# EAGLE design bcdwatch (EAGLE 6.6.0)
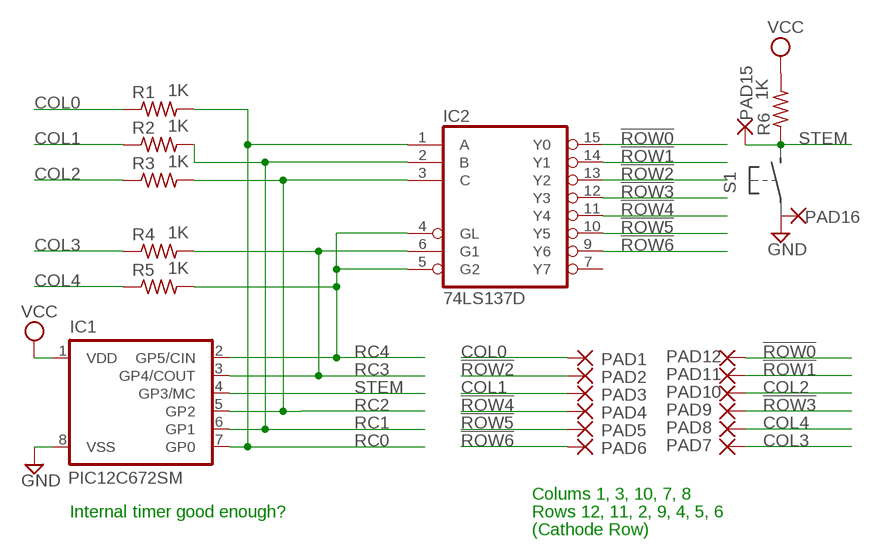
[diagram p0: schematic, sheet 1]

## Parts
IC1  PIC12C672SM  [SO-08M]
IC2  74LS137D  [SO16]
PAD1  SMD2  [SMD1,27-2,54]
PAD2  SMD2  [SMD1,27-2,54]
PAD3  SMD2  [SMD1,27-2,54]
PAD4  SMD2  [SMD1,27-2,54]
PAD5  SMD2  [SMD1,27-2,54]
PAD6  SMD2  [SMD1,27-2,54]
PAD7  SMD2  [SMD1,27-2,54]
PAD8  SMD2  [SMD1,27-2,54]
PAD9  SMD2  [SMD1,27-2,54]
PAD10  SMD2  [SMD1,27-2,54]
PAD11  SMD2  [SMD1,27-2,54]
PAD12  SMD2  [SMD1,27-2,54]
PAD15  SMD2  [SMD1,27-2,54]
PAD16  SMD2  [SMD1,27-2,54]
R1  1K  R-US_R0805  [R0805]
R2  1K  R-US_R0805  [R0805]
R3  1K  R-US_R0805  [R0805]
R4  1K  R-US_R0805  [R0805]
R5  1K  R-US_R0805  [R0805]
R6  1K  R-US_R0805  [R0805]

## Nets
!ROW0: IC2.15(Y0) PAD12.1(P)
!ROW1: IC2.14(Y1) PAD11.1(P)
!ROW2: IC2.13(Y2) PAD2.1(P)
!ROW3: IC2.12(Y3) PAD9.1(P)
!ROW4: IC2.11(Y4) PAD4.1(P)
!ROW5: IC2.10(Y5) PAD5.1(P)
!ROW6: IC2.9(Y6) PAD6.1(P)
COL0: PAD1.1(P) R1.1
COL1: PAD3.1(P) R2.1
COL2: PAD10.1(P) R3.1
COL3: PAD7.1(P) R4.1
COL4: PAD8.1(P) R5.1
GND: IC1.8(VSS) PAD16.1(P)
RC0: IC1.7(GP0) IC2.1(A) R1.2
RC1: IC1.6(GP1) IC2.2(B) R2.2
RC2: IC1.5(GP2) IC2.3(C) R3.2
RC3: IC1.3(GP4/COUT) IC2.6(G1) R4.2
RC4: IC1.2(GP5/CIN) IC2.4(GL) IC2.5(G2) R5.2
STEM: IC1.4(GP3/MC) PAD15.1(P) R6.1
VCC: IC1.1(VDD) R6.2
Unconnected: IC2.7(Y7)

## Notes on the sheet
- Colums 1, 3, 10, 7, 8
- Internal timer good enough? | Rows 12, 11, 2, 9, 4, 5, 6
- (Cathode Row)

## Power pins joined to a net without a drawn wire
GND: IC2.8(GND)
VCC: IC2.16(VCC)

## Library data of the parts
IC1 = microchip:PIC12C*?: MICROCONTROLLER; MF: MICROCHIP; MPN: PIC12C672-04/SM; OC_FARNELL: 1137297; OC_NEWARK: 72K7294
IC2 = 74xx-us:74*137: 3-line to 8-line DECODER/DEMULTIPLEXER, address LATCH
PAD1-PAD12 PAD15 PAD16 = wirepad:SMD2: SMD PAD
R1-R6 = rcl:R-US_: RESISTOR, American symbol

## Board
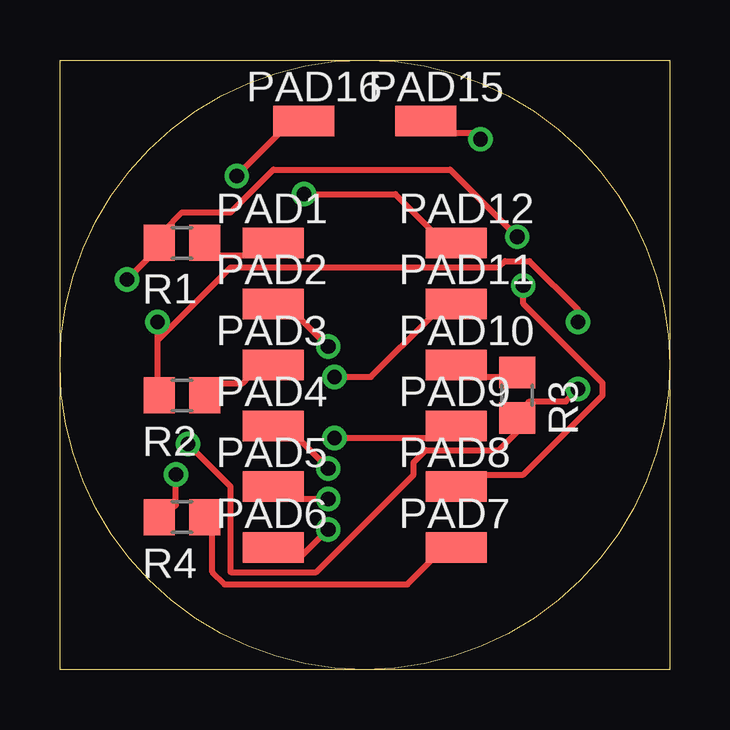
[diagram p1: board, top side]
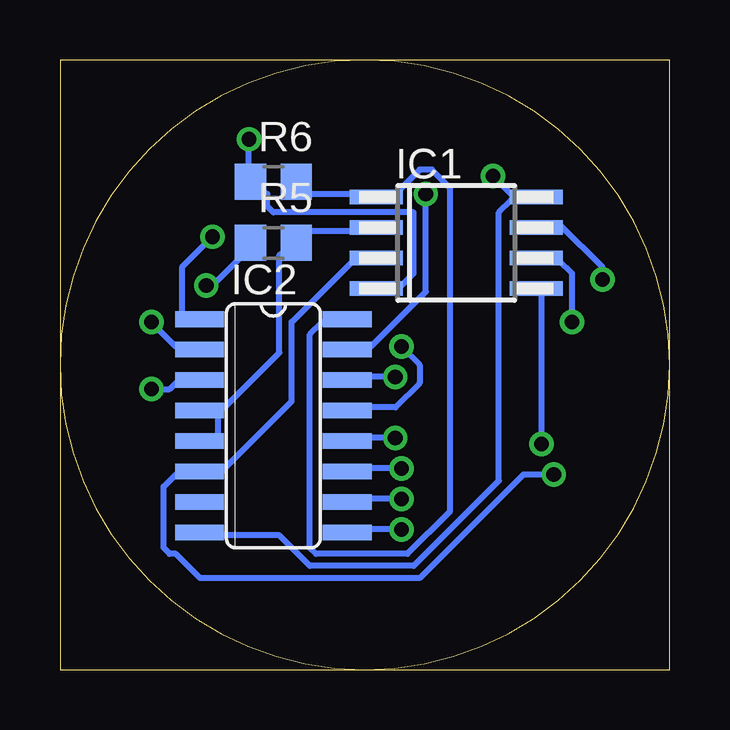
[diagram p2: board, bottom side, seen from below]

Size 25.4 x 25.4 mm. Coordinates in mm from the lower left corner, seen from the top.
Outline: 0,12.7 0,0 25.4,0 25.4,12.7
Outline: 0,12.7 0,25.4 24.13,25.4 25.4,25.4 25.4,12.7
Outline: 0,12.7 arc-180 25.4,12.7
Outline: 25.4,12.7 arc-180 0,12.7
Copper layers (1*16): Top 0.035mm / dielectric 1.5mm / Bottom 0.035mm
Design rules "default": minimum track width 10mil, minimum drill 24mil, track to track 8mil, track to pad 8mil, pad to pad 8mil, via to via 8mil, smd to smd 8mil, copper to edge 40mil, drill to drill 8mil, minimum pad ring 10mil, minimum via ring 8mil, stop-mask expansion 4mil, vias tented up to drill 0mil, thermal gap 10mil

### Footprints (pad centres in the part's own frame; a part is rotated, then mirrored left to right if it is on the bottom)
SO-08M = smd 0.6 x 2.2: 1 -1.905,-3.33; 2 -0.635,-3.33; 3 0.635,-3.33; 4 1.905,-3.33; 5 1.905,3.33; 6 0.635,3.33; 7 -0.635,3.33; 8 -1.905,3.33
SO16 = smd 0.66 x 2.032: 1 -4.445,-3.073; 2 -3.175,-3.073; 3 -1.905,-3.073; 4 -0.635,-3.073; 5 0.635,-3.073; 6 1.905,-3.073; 7 3.175,-3.073; 8 4.445,-3.073; 9 4.445,3.073; 10 3.175,3.073; 11 1.905,3.073; 12 0.635,3.073; 13 -0.635,3.073; 14 -1.905,3.073; 15 -3.175,3.073; 16 -4.445,3.073
SMD1,27-2,54 = smd 1.27 x 2.54: 1 0,0
R0805 = smd 1.3 x 1.5: 1 -0.95,0; 2 0.95,0

### Placement (x,y rotation side)
IC1  8.89,17.78 270 bottom
IC2  16.51,10.16 270 bottom
PAD1  8.89,17.78 270 top
PAD2  8.89,15.24 270 top
PAD3  8.89,12.7 270 top
PAD4  8.89,10.16 270 top
PAD5  8.89,7.62 270 top
PAD6  8.89,5.08 270 top
PAD7  16.51,5.08 270 top
PAD8  16.51,7.62 270 top
PAD9  16.51,10.16 270 top
PAD10  16.51,12.7 270 top
PAD11  16.51,15.24 270 top
PAD12  16.51,17.78 270 top
PAD15  15.24,22.86 270 top
PAD16  10.16,22.86 270 top
R1  5.08,17.78 180 top
R2  5.08,11.43 180 top
R3  19.05,11.43 270 top
R4  5.08,6.35 180 top
R5  16.51,17.78 0 bottom
R6  16.51,20.32 0 bottom

### Tracks (layer width: path | path; a pad name or v marks a point on that pad's centre or on a via)
!ROW0  (via drill 0.61)
  Top 0.254: v10.16,19.81 13.97,19.81 15.49,18.29 PAD12.1
  Bottom 0.254: v10.16,19.81 10.16,15.75 12.45,13.46 IC2.15
!ROW1  (via drill 0.61)
  Top 0.254: v11.43,12.19 12.95,12.19 15.49,14.73 PAD11.1
  Bottom 0.254: v11.43,12.19 12.45,12.19 IC2.14
!ROW2  (via drill 0.61)
  Top 0.254: v11.18,13.46 9.91,14.73 PAD2.1
  Bottom 0.254: v11.18,13.46 10.41,12.7 10.41,11.94 11.43,10.92 12.45,10.92 IC2.13
!ROW3  (via drill 0.61)
  Top 0.254: v11.43,9.65 15.49,9.65 PAD9.1
  Bottom 0.254: v11.43,9.65 12.45,9.65 IC2.12
!ROW4  (via drill 0.61)
  Top 0.254: v11.18,8.38 9.91,9.65 PAD4.1
  Bottom 0.254: v11.18,8.38 12.45,8.38 IC2.11
!ROW5  (via drill 0.61)
  Top 0.254: v11.18,7.11 9.91,7.11 PAD5.1
  Bottom 0.254: v11.18,7.11 12.45,7.11 IC2.10
!ROW6  (via drill 0.61)
  Top 0.254: v11.18,5.84 9.91,4.57 PAD6.1
  Bottom 0.254: v11.18,5.84 12.45,5.84 IC2.9
COL0
  Top 0.254: R1.1 6.35,17.27 7.87,17.27 PAD1.1
COL1
  Top 0.254: R2.1 6.35,11.94 7.62,11.94 7.87,12.19 PAD3.1
COL2
  Top 0.254: R3.1 18.54,12.19 17.53,12.19 PAD10.1
COL3
  Top 0.254: R4.1 6.35,5.84 6.35,4.06 6.86,3.56 14.48,3.56 15.49,4.57 PAD7.1
COL4  (via drill 0.61)
  Top 0.254: v19.3,16 19.3,15.24 22.61,11.94 22.61,11.43 19.3,8.13 17.53,8.13 PAD8.1
  Bottom 0.254: v19.3,16 19.05,16 17.78,17.27 R5.1
GND  (via drill 0.61)
  Top 0.254: v7.37,20.57 9.14,22.35 PAD16.1
  Bottom 0.254: IC2.8 18.8,5.59 16.26,5.59 14.99,4.32 10.67,4.32 7.11,7.87 7.11,19.05 6.6,19.56 IC1.8 6.6,19.81 v7.37,20.57
RC0  (via drill 0.61)
  Top 0.254: v2.79,16.26 3.81,17.27 R1.2 4.32,18.29 5.08,19.05 7.11,19.05 8.89,20.83 16.26,20.83 v19.05,18.03
  Bottom 0.254: v2.79,16.26 2.79,16.76 4.57,18.54 IC1.7 | v19.05,18.03 20.32,16.76 20.32,14.73 IC2.1
RC1  (via drill 0.61)
  Top 0.254: 4.06,13.72 v4.06,14.48 | 4.06,13.72 4.06,11.94 R2.2 | v21.59,14.48 21.59,14.99 19.56,17.02 18.54,17.02 18.29,16.76 7.11,16.76 4.06,13.72
  Bottom 0.254: v4.06,14.48 4.06,16.51 4.57,17.02 IC1.6 | v21.59,14.48 20.57,13.46 IC2.2
RC2  (via drill 0.61)
  Top 0.254: v21.59,11.68 21.08,11.18 19.56,11.18 R3.2 19.3,10.16 18.29,9.14 15.24,9.14 14.73,8.64 14.73,8.13 10.67,4.06 7.11,4.06 7.11,7.62 v5.33,9.4
  Bottom 0.254: v21.59,11.68 20.83,11.68 20.57,11.94 IC2.3 | v5.33,9.4 5.33,15.75 IC1.5
RC3  (via drill 0.61)
  Top 0.254: v4.83,8.13 4.83,6.86 R4.2
  Bottom 0.254: v4.83,8.13 6.1,8.13 10.41,3.81 19.56,3.81 20.57,4.83 20.83,4.83 21.08,5.08 21.08,7.62 20.57,8.13 IC2.6 18.8,8.13 15.75,11.18 15.75,14.48 13.21,17.02 IC1.3
RC4
  Bottom 0.254: IC2.5 18.8,9.65 18.8,10.67 IC2.4 18.8,10.92 18.54,10.92 16.26,13.21 16.26,17.27 R5.2 15.24,18.29 13.21,18.29 IC1.2
STEM  (via drill 0.61)
  Top 0.254: v17.53,22.1 17.27,22.35 16.26,22.35 PAD15.1
  Bottom 0.254: IC1.4 11.18,16 10.67,16.51 10.67,19.05 16.51,19.05 16.76,19.3 16.76,19.81 R6.1 17.53,20.83 v17.53,22.1
VCC
  Bottom 0.254: R6.2 15.24,19.81 13.21,19.81 IC1.1 11.43,19.81 10.41,20.83 9.91,20.83 9.14,20.07 9.14,6.6 10.92,4.83 14.73,4.83 14.99,5.08 14.99,13.97 14.48,14.48 14.22,14.48 IC2.16